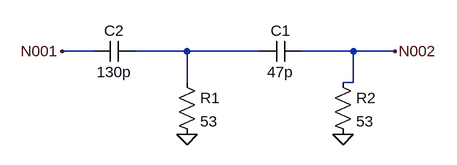
[diagram p0: schematic FiltroPasaAltasConcentrados.asc]
FiltroPasaAltasConcentrados.asc, the LTspice schematic file:
Version 4
SHEET 1 880 680
WIRE 0 64 -48 64
WIRE 144 64 64 64
WIRE 256 64 144 64
WIRE 400 64 320 64
WIRE 464 64 400 64
WIRE 144 112 144 64
WIRE 400 112 400 64
WIRE 400 112 384 112
FLAG -48 64 N001
FLAG 464 64 N002
FLAG 144 192 0
FLAG 384 192 0
SYMBOL res 128 96 R0
SYMATTR InstName R1
SYMATTR Value 53
SYMBOL res 368 96 R0
SYMATTR InstName R2
SYMATTR Value 53
SYMBOL cap 320 48 R90
WINDOW 0 0 32 VBottom 2
WINDOW 3 32 32 VTop 2
SYMATTR InstName C1
SYMATTR Value 47p
SYMBOL cap 64 48 R90
WINDOW 0 0 32 VBottom 2
WINDOW 3 32 32 VTop 2
SYMATTR InstName C2
SYMATTR Value 130p

The netlist it stands for:
* FiltroPasaAltasConcentrados.asc
R1 N003 0 53
R2 N002 0 53
C1 N002 N003 47p
C2 N003 N001 130p
.backanno
.end